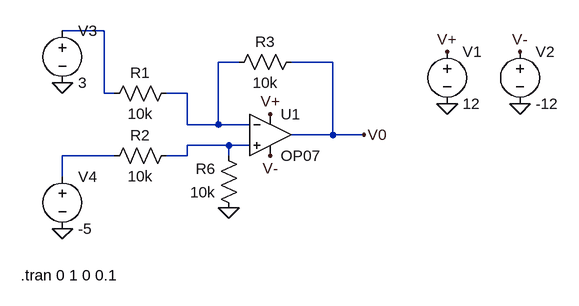
[diagram p0: schematic PrelabWk3Ideal.asc]
PrelabWk3Ideal.asc, the LTspice schematic file:
Version 4
SHEET 1 880 680
WIRE -16 16 -80 16
WIRE 192 64 160 64
WIRE 336 64 272 64
WIRE -16 112 -16 16
WIRE 0 112 -16 112
WIRE 112 112 80 112
WIRE 112 160 112 112
WIRE 160 160 160 64
WIRE 160 160 112 160
WIRE 208 160 160 160
WIRE 336 176 336 64
WIRE 336 176 272 176
WIRE 384 176 336 176
WIRE 176 192 112 192
WIRE 208 192 176 192
WIRE 0 208 -80 208
WIRE 112 208 112 192
WIRE 112 208 80 208
WIRE 176 208 176 192
WIRE -80 240 -80 208
FLAG 512 48 V+
FLAG 240 144 V+
FLAG 240 208 V-
FLAG 624 48 V-
FLAG 512 128 0
FLAG 624 128 0
FLAG 384 176 V0
FLAG -80 96 0
FLAG -80 320 0
FLAG 176 288 0
SYMBOL OpAmps\\OP07 240 112 R0
SYMATTR InstName U1
SYMBOL voltage 512 32 R0
SYMATTR InstName V1
SYMATTR Value 12
SYMBOL voltage 624 32 R0
SYMATTR InstName V2
SYMATTR Value -12
SYMBOL res 96 96 R90
WINDOW 0 0 56 VBottom 2
WINDOW 3 32 56 VTop 2
SYMATTR InstName R1
SYMATTR Value 10k
SYMBOL res 96 192 R90
WINDOW 0 0 56 VBottom 2
WINDOW 3 32 56 VTop 2
SYMATTR InstName R2
SYMATTR Value 10k
SYMBOL res 288 48 R90
WINDOW 0 0 56 VBottom 2
WINDOW 3 32 56 VTop 2
SYMATTR InstName R3
SYMATTR Value 10k
SYMBOL res 192 304 R180
WINDOW 0 36 76 Left 2
WINDOW 3 36 40 Left 2
SYMATTR InstName R6
SYMATTR Value 10k
SYMBOL voltage -80 0 R0
SYMATTR InstName V3
SYMATTR Value 3
SYMBOL voltage -80 224 R0
SYMATTR InstName V4
SYMATTR Value -5
TEXT -144 392 Left 2 !.tran 0 1 0 0.1

The netlist it stands for:
* PrelabWk3Ideal.asc
XU1 N003 N002 V+ V- V0 LT1001  ; OP07, pins In+ In- V+ V- OUT
V1 V+ 0 12
V2 V- 0 -12
R1 N002 N001 10k
R2 N003 N004 10k
R3 V0 N002 10k
R6 0 N003 10k
V3 N001 0 3
V4 N004 0 -5
.tran 0 1 0 0.1
.lib LTC.lib
.backanno
.end